# Altium schematic sheet 02_I2C_V1-0.SchDoc: RPi GS CAM SER.
size A3; Date: 2023-05-29; Author: M. Weimann; Organization: Altium Limited; Revision: 1.0; SheetNumber: 3; SheetTotal: 5; Title_Subtitle: I2C; Language: DE; Department: F&E; Filename: RPi-GS-CAM-SER_PCB_V1-0.PDF; Project: PI-0017; DocType: Stromlauf; ItemNo-PCB: n/a
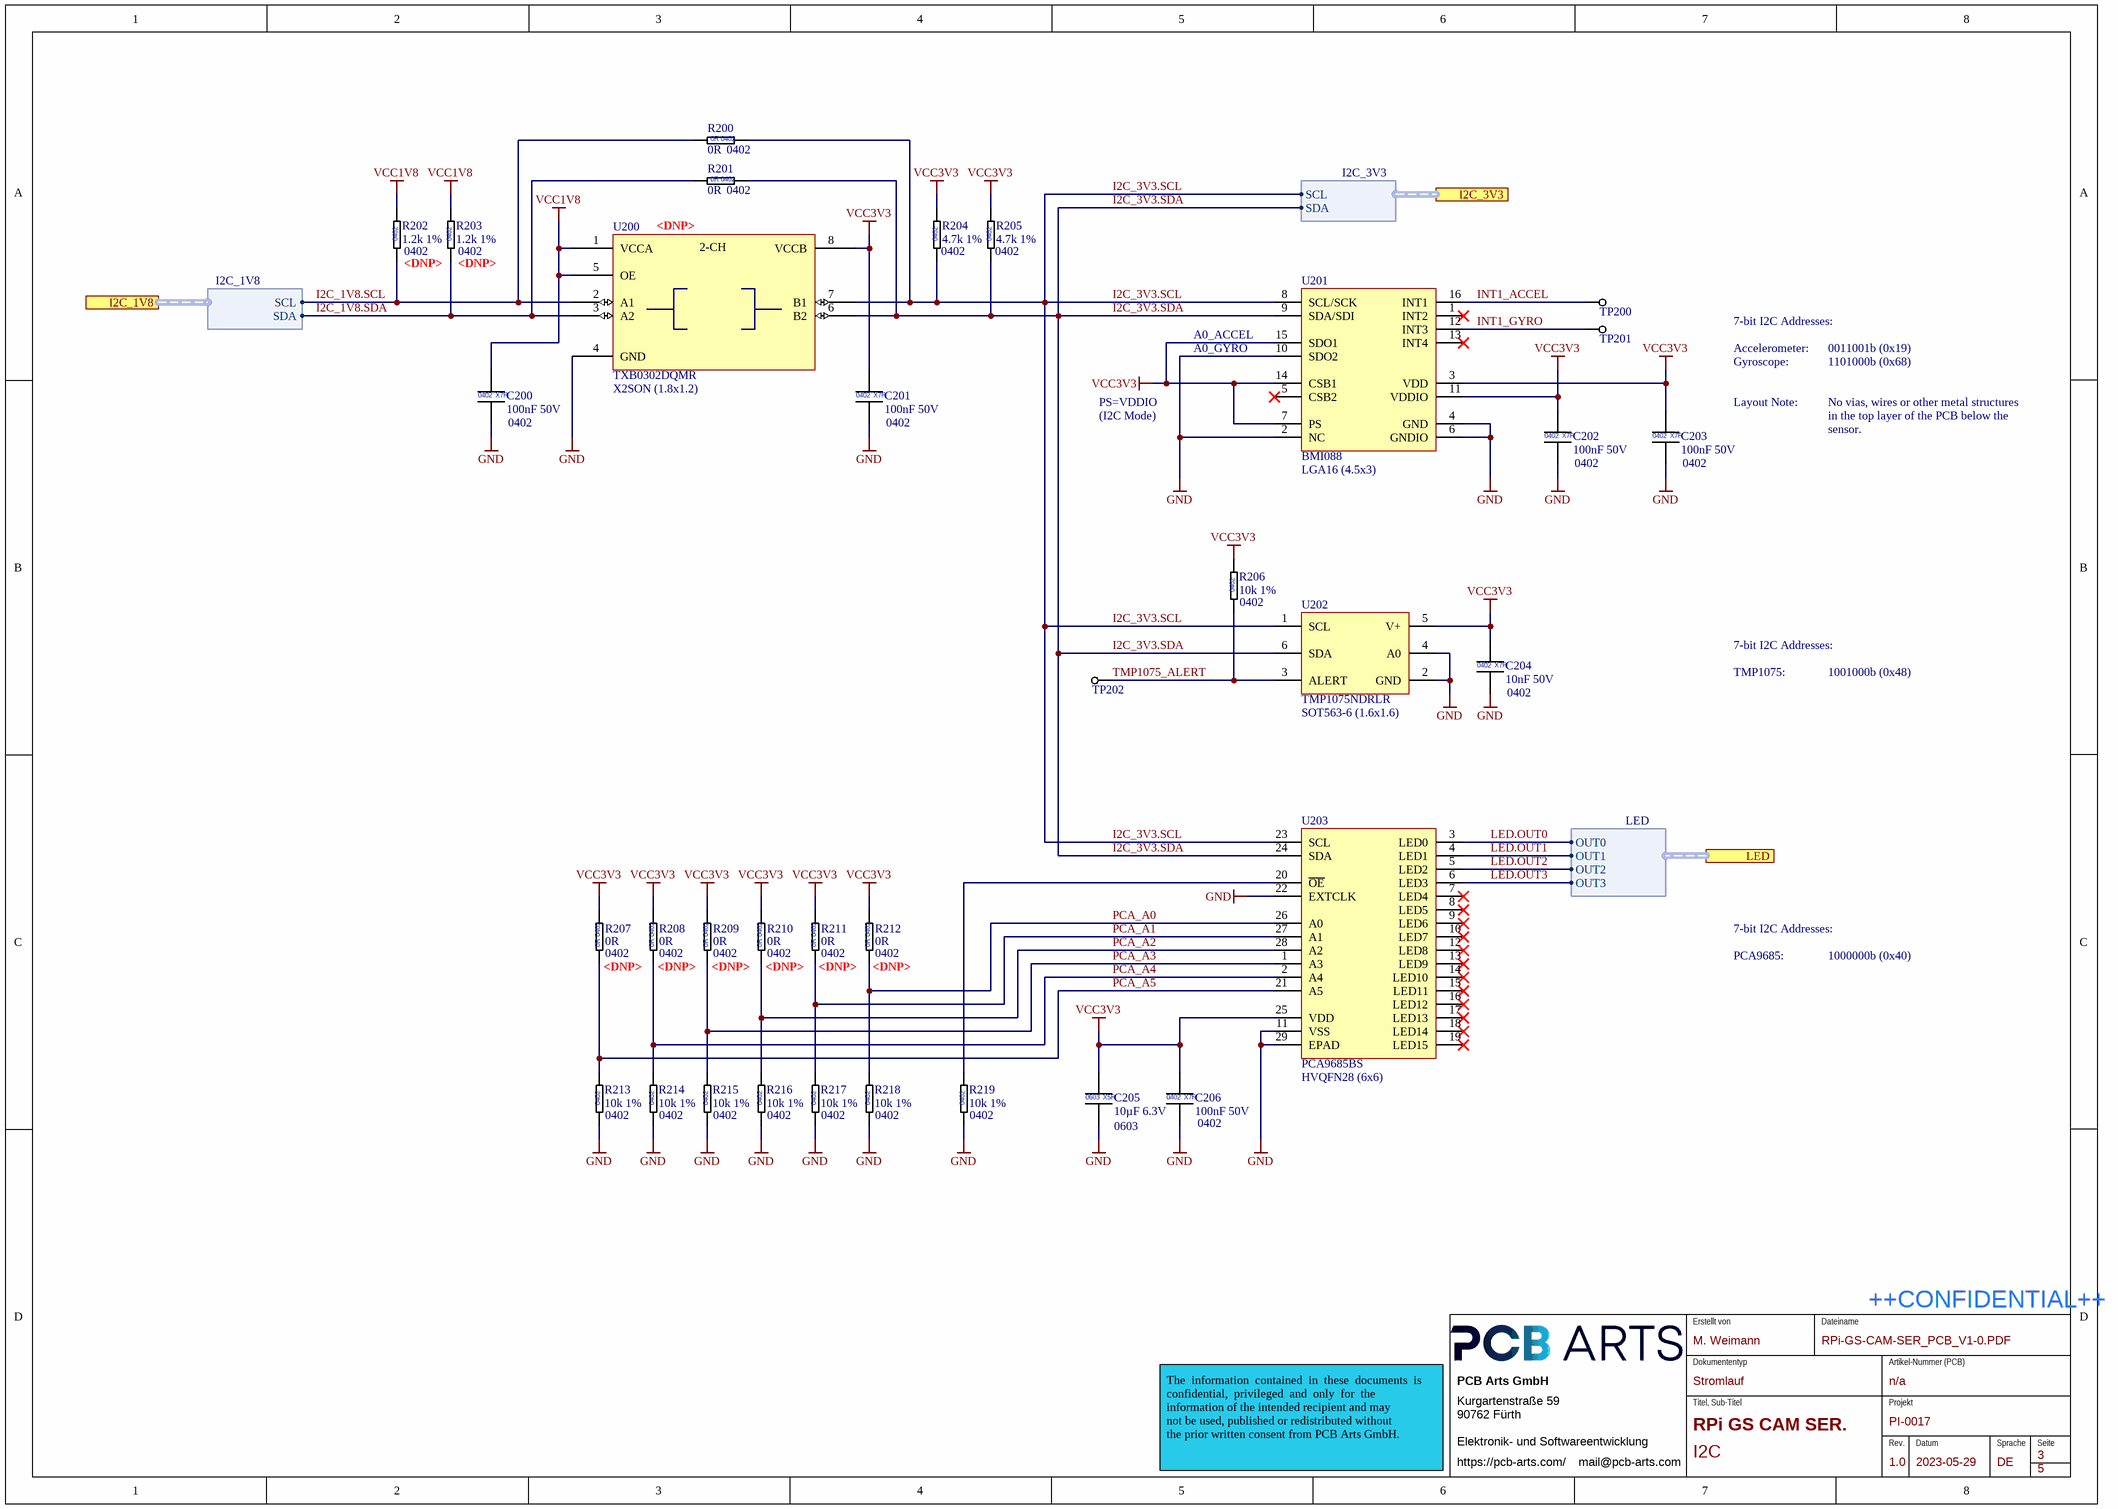
[diagram p0: 02_I2C_V1-0.SchDoc]

## Parts
C200  100nF 50V  [CAP_0402_L]
C201  100nF 50V  [CAP_0402_L]
C202  100nF 50V  [CAP_0402_L]
C203  100nF 50V  [CAP_0402_L]
C204  10nF 50V  [CAP_0402_L]
C205  10µF 6.3V  [CAP_0603_L]
C206  100nF 50V  [CAP_0402_L]
R200  0R Jumper  [RES_0402_L]  (value not drawn)
R201  0R Jumper  [RES_0402_L]  (value not drawn)
R202  1.2k 1%  [RES_0402_L]  (no BOM)
R203  1.2k 1%  [RES_0402_L]  (no BOM)
R204  4.7k 1%  [RES_0402_L]
R205  4.7k 1%  [RES_0402_L]
R206  10k 1%  [RES_0402_L]
R207  0R Jumper  [RES_0402_L]  (value not drawn)  (no BOM)
R208  0R Jumper  [RES_0402_L]  (value not drawn)  (no BOM)
R209  0R Jumper  [RES_0402_L]  (value not drawn)  (no BOM)
R210  0R Jumper  [RES_0402_L]  (value not drawn)
R211  0R Jumper  [RES_0402_L]  (value not drawn)  (no BOM)
R212  0R Jumper  [RES_0402_L]  (value not drawn)  (no BOM)
R213  10k 1%  [RES_0402_L]
R214  10k 1%  [RES_0402_L]
R215  10k 1%  [RES_0402_L]
R216  10k 1%  [RES_0402_L]
R217  10k 1%  [RES_0402_L]
R218  10k 1%  [RES_0402_L]
R219  10k 1%  [RES_0402_L]
TP200  Testpoint  [Testpoint 0.8mm]  (value not drawn)  (no BOM)
TP201  Testpoint  [Testpoint 0.8mm]  (value not drawn)  (no BOM)
TP202  Testpoint  [Testpoint 0.8mm]  (value not drawn)  (no BOM)
U200  TXB0302DQMR  [SON40P120X40-8N]  (no BOM)
U201  BMI088  [LGA50P450X300X100-16N]
U202  TMP1075NDRLR  [SOT50P160X60-6N_SOT563]
U203  PCA9685BS  [QFN65P600X600X100_HS-29N]

## Ports
I2C_1V8 (harness I2C_1V8, see 00_RPi-GS-CAM-SER_V1-0[4B], 01_SERIALIZER_V1-0[7A]), I2C_3V3 (harness I2C_3V3, see 00_RPi-GS-CAM-SER_V1-0[5B], 03_CONNECTORS_V1-0[1B]), LED (harness LED, see 00_RPi-GS-CAM-SER_V1-0[5B], 03_CONNECTORS_V1-0[1C])

## Harnesses
LED: OUT0, OUT1, OUT2, OUT3
I2C_1V8: SCL, SDA
I2C_3V3: SCL, SDA

## Nets
GND: C200.2 C201.2 C202.2 C203.2 C204.2 C205.2 C206.2 R213.1 R214.1 R215.1 R216.1 R217.1 R218.1 R219.1 U200.4(GND) U201.2(NC) U201.4(GND) U201.6(GNDIO) U201.10(SDO2) U202.2(GND) U202.4(A0) U203.11(VSS) U203.22(EXTCLK) U203.29(EPAD)
VCC1V8: C200.1 R202.2 R203.2 U200.1(VCCA) U200.5(OE)
VCC3V3: C201.1 C202.1 C203.1 C204.1 C205.1 C206.1 R204.2 R205.2 R206.2 R207.2 R208.2 R209.2 R210.2 R211.2 R212.2 U200.8(VCCB) U201.3(VDD) U201.7(PS) U201.11(VDDIO) U201.14(CSB1) U201.15(SDO1) U202.5(V+) U203.25(VDD)
I2C_1V8.SCL: R200.1 R202.1 U200.2(A1) ; port I2C_1V8.SCL
I2C_1V8.SDA: R201.1 R203.1 U200.3(A2) ; port I2C_1V8.SDA
I2C_3V3.SCL: R200.2 R204.1 U200.7(B1) U201.8(SCL/SCK) U202.1(SCL) U203.23(SCL) ; port I2C_3V3.SCL
I2C_3V3.SDA: R201.2 R205.1 U200.6(B2) U201.9(SDA/SDI) U202.6(SDA) U203.24(SDA) ; port I2C_3V3.SDA
INT1_ACCEL: TP200.1(GND) U201.16(INT1)
INT1_GYRO: TP201.1(GND) U201.12(INT3)
LED.OUT0: U203.3(LED0) ; port LED.OUT0
LED.OUT1: U203.4(LED1) ; port LED.OUT1
LED.OUT2: U203.5(LED2) ; port LED.OUT2
LED.OUT3: U203.6(LED3) ; port LED.OUT3
PCA_A0: R212.1 R218.2 U203.26(A0)
PCA_A1: R211.1 R217.2 U203.27(A1)
PCA_A2: R210.1 R216.2 U203.28(A2)
PCA_A3: R209.1 R215.2 U203.1(A3)
PCA_A4: R208.1 R214.2 U203.2(A4)
PCA_A5: R207.1 R213.2 U203.21(A5)
TMP1075_ALERT: R206.1 TP202.1(GND) U202.3(ALERT)
NetR219_2: R219.2 U203.20(~{OE})

Not connected (* = marked no-connect by the designer): U201 1(INT2)* 5(CSB2)* 13(INT4)*; U203 7(LED4)* 8(LED5)* 9(LED6)* 10(LED7)* 12(LED8)* 13(LED9)* 14(LED10)* 15(LED11)* 16(LED12)* 17(LED13)* 18(LED14)* 19(LED15)*

## Notes on the sheet
- (near R200) 0R
- (near R200) 0402
- (near U200) <DNP>
- (near R201) 0R
- (near R201) 0402
- (near R202) 0402
- <DNP>
- (near R203) 0402
- (near R203) <DNP>
- (near R204) 0402
- (near R205) 0402
- A0_GYRO
- A0_ACCEL
- Accelerometer:
- 7-bit I2C Addresses:
- Gyroscope:
- 0011001b (0x19)
- 1101000b (0x68)
- (near C200) 0402
- (near U200) X2SON (1.8x1.2)
- (near C201) 0402
- PS=VDDIO
- (I2C Mode)
- Layout Note:
- No vias, wires or other metal structures
- in the top layer of the PCB below the
- sensor.
- (near U201) LGA16 (4.5x3)
- (near C202) 0402
- (near C203) 0402
- (near R206) 0402
- (near U202) SOT563-6 (1.6x1.6)
- (near C204) 0402
- TMP1075:
- 1001000b (0x48)
- (near R207) <DNP>
- (near R207) 0402
- (near R207) 0R
- (near R208) <DNP>
- (near R208) 0402
- (near R208) 0R
- (near R209) <DNP>
- (near R209) 0402
- (near R209) 0R
- (near R210) <DNP>
- (near R210) 0402
- (near R210) 0R
- (near R211) <DNP>
- (near R211) 0402
- (near R211) 0R
- (near R212) <DNP>
- (near R212) 0402
- (near R212) 0R
- PCA9685:
- 1000000b (0x40)
- (near R213) 0402
- (near R214) 0402
- (near R215) 0402
- (near R216) 0402
- (near R217) 0402
- (near R218) 0402
- (near R219) 0402
- (near C206) 0402
- (near U203) HVQFN28 (6x6)
- (near C205) 0603
- Erstellt von
- Dateiname
- ++CONFIDENTIAL++
- PCB Arts GmbH
- Dokumententyp
- Artikel-Nummer (PCB)
- Kurgartenstraße 59
- 90762 Fürth
- Elektronik- und Softwareentwicklung
- Titel, Sub-Titel
- Projekt
- Rev.
- Datum
- Sprache
- Seite
- The  information  contained  in  these  documents  is  confidential,  privileged  and  only  for  the
  information of the intended recipient and may
  not be used, published or redistributed without
  the prior written consent from PCB Arts GmbH.
- https://pcb-arts.com/
- mail@pcb-arts.com
- (in symbol CAP_0402_10nF_50V) 0402; X7R
- (in symbol CAP_0402_100nF_50V) 0402; X7R
- (in symbol CAP_0603_10µF_6.3V) 0603; X5R
- (in symbol RES_0402_0R Jumper) 0R 0402
- (in symbol RES_0402_1.2k_1%) 0402
- (in symbol RES_0402_4.7k_1%) 0402
- (in symbol RES_0402_10k_1%) 0402
- (in symbol TXB0302DQMR_Translation - Voltage Levels 2B Bidir Vltg-Level Translator) 2-CH

## Library data of the parts
C200-C203 C206 = CAP_0402_100nF_50V: Multilayer Ceramic Capacitors MLCC - SMD/SMT 0402 50VDC; Manufacturer 1: Murata Electronics; Manufacturer 1 Prt. Nr.: GCM155L8EH104KE07D; Manufacturer 2 Prt. Nr.: UMK105B7104KV-FR; Manufacturer 2: TDK
C204 = CAP_0402_10nF_50V: Multilayer Ceramic Capacitors MLCC - SMD/SMT 0402 50VDC; Manufacturer 1: Wurth Elektronik; Manufacturer 1 Prt. Nr.: 885012205067; Manufacturer 2 Prt. Nr.: AC0402KPX7R9BB103; Manufacturer 2: Yageo
C205 = CAP_0603_10µF_6.3V: Multilayer Ceramic Capacitors MLCC - SMD/SMT 0603 6.3VDC; Manufacturer 1: Murata Electronics; Manufacturer 1 Prt. Nr.: GRM188R60J106ME84J; Manufacturer 2 Prt. Nr.: JMK107ABJ106MA-T; Manufacturer 2: Taiyo Yuden
R200 R201 R207-R212 = RES_0402_0R Jumper: Thick Film Resistors - SMD 0Ohm; Manufacturer 1: Vishay / Dale; Manufacturer 1 Prt. Nr.: CRCW04020000Z0EDC; Manufacturer 2 Prt. Nr.: RC0402JR-070RL; Manufacturer 2: Yageo
R202 R203 = RES_0402_1.2k_1%: Thick Film Resistors - SMD 1/16watt 1.2Kohms 1%; Manufacturer 1: Vishay / Dale; Manufacturer 1 Prt. Nr.: CRCW04021K20FKEDC; Manufacturer 2 Prt. Nr.: RC0402FR-7W1K2L; Manufacturer 2: Yageo
R204 R205 = RES_0402_4.7k_1%: Thick Film Resistors - SMD 4.7kOhm 1%; Manufacturer 1: Vishay / Dale; Manufacturer 1 Prt. Nr.: CRCW04024K70FKEDC; Manufacturer 2 Prt. Nr.: RC0402FR-134K7L; Manufacturer 2: Yageo
R206 R213-R219 = RES_0402_10k_1%: Thick Film Resistors - SMD 10kOhm 1%; Manufacturer 1: Vishay / Dale; Manufacturer 1 Prt. Nr.: CRCW040210K0FKEDC; Manufacturer 2 Prt. Nr.: RC0402FR-7W10KL; Manufacturer 2: Yageo
TP200-TP202 = Testpoint 0.8mm
U200 = TXB0302DQMR_Translation - Voltage Levels 2B Bidir Vltg-Level Translator: Translation - Voltage Levels 2B Bidir Vltg-Level Translator; Manufacturer 1: Texas Instruments; Manufacturer 1 Prt. Nr.: TXB0302DQMR
U201 = BMI088_High_Performance_Intertial_Measurement_Unit_(IMU): IMUs - High Performance Intertial Measurement Unit (IMU) for Drones and Robotics LGA16 4,5 mm x 3,0 mm; Manufacturer 1: Bosch Sensortec; Manufacturer 1 Prt. Nr.: BMI088
U202 = TMP1075NDRLR_Board_Mount_I2C_Temperature_Sensor: Board Mount I2C Temperature Sensors with performance upgrades to industry standard LM75 / TMP75  SOT563 1,6 mm x 1,6 mm; Manufacturer 1: Texas Instruments; Manufacturer 1 Prt. Nr.: TMP1075NDRLR
U203 = PCA9685BS_16-CH_12-BIT-PWM_I2C_LED-CTRL: LED-Anzeigetreiber 16-CH 12-BIT PWM FM+ I2C-BUS LED CTRL HVQFN28 6 mm x 6 mm; Manufacturer 1: NXP; Manufacturer 1 Prt. Nr.: PCA9685BS, 118